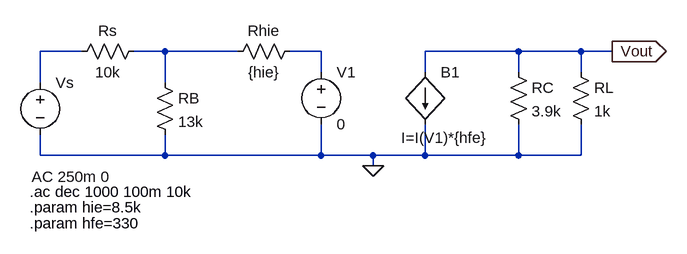
[diagram p0: schematic ModeloHibrido.asc]
ModeloHibrido.asc, the LTspice schematic file:
Version 4
SHEET 1 992 680
WIRE 64 96 0 96
WIRE 192 96 144 96
WIRE 304 96 192 96
WIRE 432 96 384 96
WIRE 736 96 592 96
WIRE 832 96 736 96
WIRE 880 96 832 96
WIRE 432 128 432 96
WIRE 592 128 592 96
WIRE 736 128 736 96
WIRE 832 128 832 96
WIRE 0 144 0 96
WIRE 192 144 192 96
WIRE 0 256 0 224
WIRE 192 256 192 224
WIRE 192 256 0 256
WIRE 432 256 432 208
WIRE 432 256 192 256
WIRE 512 256 432 256
WIRE 592 256 592 208
WIRE 592 256 512 256
WIRE 736 256 736 208
WIRE 736 256 592 256
WIRE 832 256 832 208
WIRE 832 256 736 256
WIRE 512 272 512 256
FLAG 880 96 Vout
IOPIN 880 96 Out
FLAG 512 272 0
SYMBOL voltage 0 128 R0
WINDOW 123 -13 161 Left 2
WINDOW 39 0 0 Left 0
SYMATTR InstName Vs
SYMATTR Value ""
SYMATTR Value2 AC 250m 0
SYMBOL res 160 80 R90
WINDOW 0 0 56 VBottom 2
WINDOW 3 32 56 VTop 2
SYMATTR InstName Rs
SYMATTR Value 10k
SYMBOL res 176 128 R0
SYMATTR InstName RB
SYMATTR Value 13k
SYMBOL res 400 80 R90
WINDOW 0 0 56 VBottom 2
WINDOW 3 32 56 VTop 2
SYMATTR InstName Rhie
SYMATTR Value {hie}
SYMBOL voltage 432 112 R0
SYMATTR InstName V1
SYMATTR Value 0
SYMBOL bi 592 128 R0
WINDOW 3 -37 101 Left 2
SYMATTR InstName B1
SYMATTR Value I=I(V1)*{hfe}
SYMBOL res 720 112 R0
SYMATTR InstName RC
SYMATTR Value 3.9k
SYMBOL res 816 112 R0
SYMATTR InstName RL
SYMATTR Value 1k
TEXT -16 312 Left 2 !.ac dec 1000 100m 10k
TEXT -16 336 Left 2 !.param hie=8.5k
TEXT -16 360 Left 2 !.param hfe=330

The netlist it stands for:
* ModeloHibrido.asc
Vs N001 0 AC 250m 0
Rs N002 N001 10k
RB N002 0 13k
Rhie N003 N002 {hie}
V1 N003 0 0
B1 Vout 0 I=I(V1)*{hfe}
RC Vout 0 3.9k
RL Vout 0 1k
.ac dec 1000 100m 10k
.param hie=8.5k
.param hfe=330
.backanno
.end